# Altium schematic sheet Energy_Harvesting.SchDoc
size A4
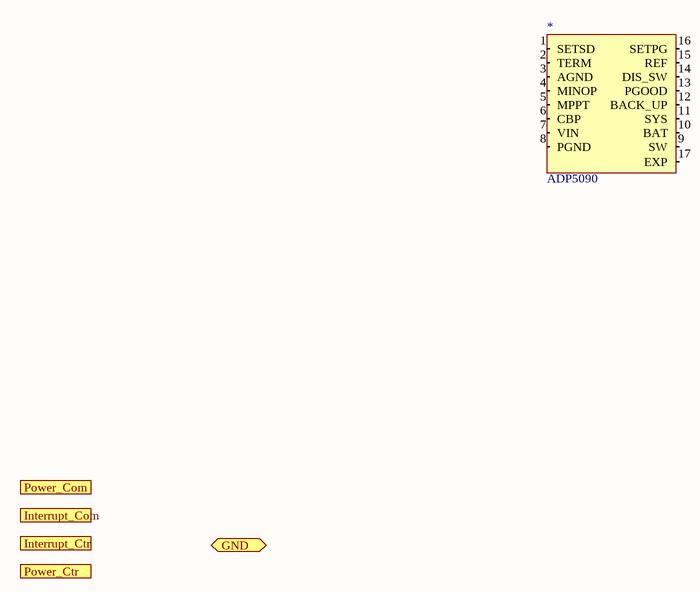
[diagram p0: Energy_Harvesting.SchDoc]

## Parts
*  ADP5090

## Ports
GND (bidir), Interrupt_Com (in), Interrupt_Ctr (out), Power_Com (out), Power_Ctr (out)

## Nets

Not connected (* = marked no-connect by the designer): * 1(SETSD) 2(TERM) 3(AGND) 4(MINOP) 5(MPPT) 6(CBP) 7(VIN) 8(PGND) 9(SW) 10(BAT) 11(SYS) 12(BACK_UP) 13(PGOOD) 14(DIS_SW) 15(REF) 16(SETPG) 17(EXP)

## Library data of the parts
* = ADP5090: Ultralow Power Boost Regulator with / MPPT and Charge Management